# EAGLE design 614_donkey_sch (EAGLE 9.5.1)

## Sheet 1 of 2
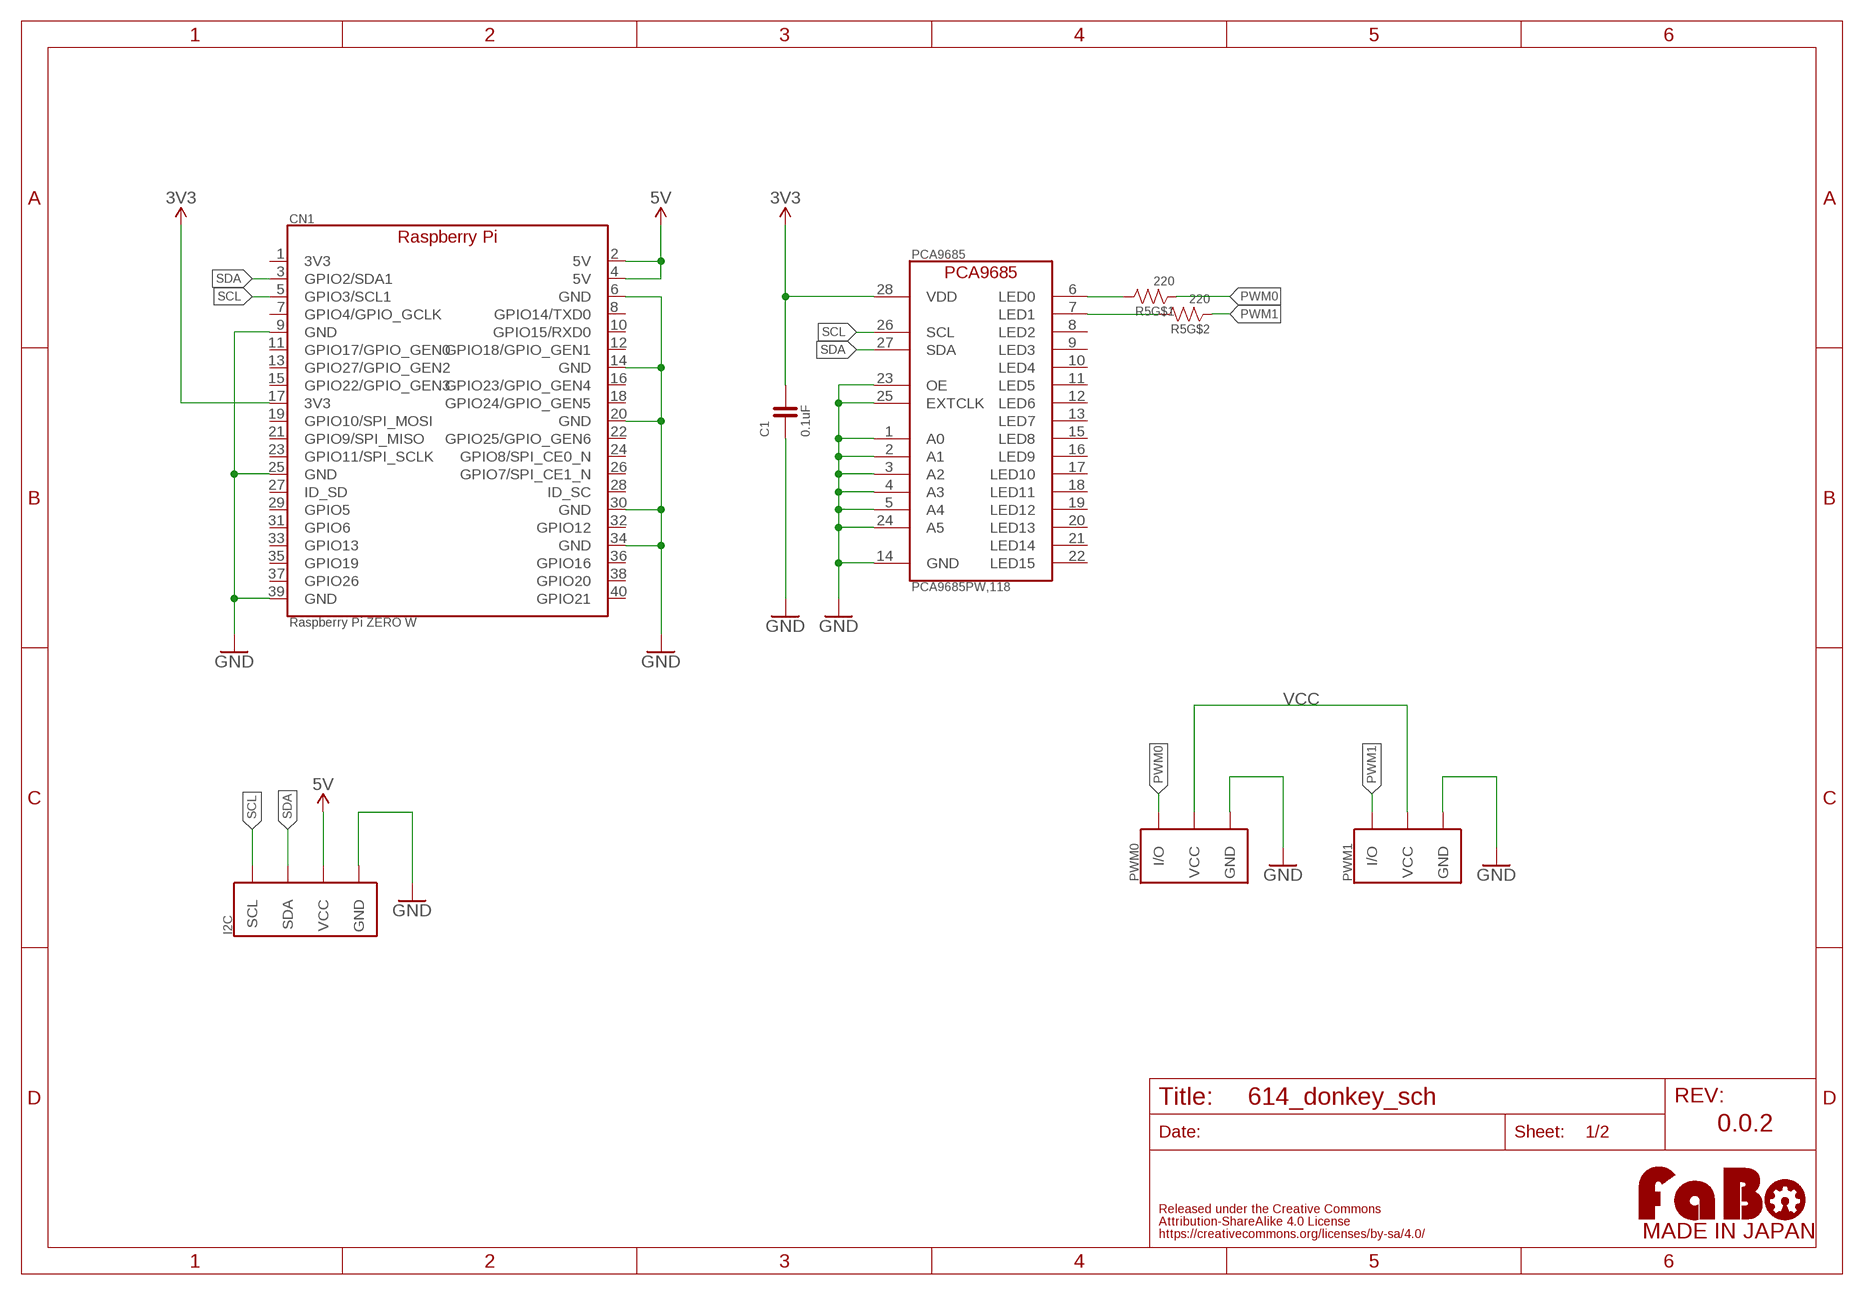
[diagram p0: schematic, sheet 1]

### Parts
C1  0.1uF  CAPACITOR-0603  [EIA0603]
CN1  Raspberry Pi ZERO W  RASPBERRY_CON  [PIN_2X20_NARROW]
I2C  FABO-BRICK-I2C_SIDE_SMD_BOSS  [SM04B-PASS-1]
LOGO1  LOGO_FABO-M  [LOGO_FABO_M]
PCA9685  PCA9685PW,118  PCA9685PW  [TSSOP-28]
PWM0  FABO-BRICK-3PIN_HEADER  [PIN_1X3_NARROW]
PWM1  FABO-BRICK-3PIN_HEADER  [PIN_1X3_NARROW]
R5  220  RESISTOR_ARRAY  [EXBV8V]

### Nets
3V3: C1.2 CN1.17(3V3) PCA9685.28(VDD)
5V: CN1.2(5V) CN1.4(5V) I2C.3(VCC) ; also sheet 2
GND: C1.1 CN1.6(GND) CN1.9(GND) CN1.14(GND) CN1.20(GND) CN1.25(GND) CN1.30(GND) CN1.34(GND) CN1.39(GND) I2C.4(GND) PCA9685.1(A0) PCA9685.2(A1) PCA9685.3(A2) PCA9685.4(A3) PCA9685.5(A4) PCA9685.14(GND) PCA9685.23(OE) PCA9685.24(A5) PCA9685.25(EXTCLK) PWM0.3(GND) PWM1.3(GND) ; also sheet 2
PIN_LED0: PCA9685.6(LED0) R5.8
PIN_LED1: PCA9685.7(LED1) R5.7
PWM0: PWM0.1(I/O) R5.1
PWM1: PWM1.1(I/O) R5.2
SCL: CN1.5(GPIO3/SCL1) I2C.1(SCL) PCA9685.26(SCL) ; also sheet 2
SDA: CN1.3(GPIO2/SDA1) I2C.2(SDA) PCA9685.27(SDA) ; also sheet 2
VCC: PWM0.2(VCC) PWM1.2(VCC)
Unconnected: CN1.1(3V3) CN1.7(GPIO4/GPIO_GCLK) CN1.8(GPIO14/TXD0) CN1.10(GPIO15/RXD0) CN1.11(GPIO17/GPIO_GEN0) CN1.12(GPIO18/GPIO_GEN1) CN1.13(GPIO27/GPIO_GEN2) CN1.15(GPIO22/GPIO_GEN3) CN1.16(GPIO23/GPIO_GEN4) CN1.18(GPIO24/GPIO_GEN5) CN1.19(GPIO10/SPI_MOSI) CN1.21(GPIO9/SPI_MISO) CN1.22(GPIO25/GPIO_GEN6) CN1.23(GPIO11/SPI_SCLK) CN1.24(GPIO8/SPI_CE0_N) CN1.26(GPIO7/SPI_CE1_N) CN1.27(ID_SD) CN1.28(ID_SC) CN1.29(GPIO5) CN1.31(GPIO6) CN1.32(GPIO12) CN1.33(GPIO13) CN1.35(GPIO19) CN1.36(GPIO16) CN1.37(GPIO26) CN1.38(GPIO20) CN1.40(GPIO21) PCA9685.8(LED2) PCA9685.9(LED3) PCA9685.10(LED4) PCA9685.11(LED5) PCA9685.12(LED6) PCA9685.13(LED7) PCA9685.15(LED8) PCA9685.16(LED9) PCA9685.17(LED10) PCA9685.18(LED11) PCA9685.19(LED12) PCA9685.20(LED13) PCA9685.21(LED14) PCA9685.22(LED15) R5.3 R5.4 R5.5 R5.6

### Notes on the sheet
- 0.0.2

## Sheet 2 of 2
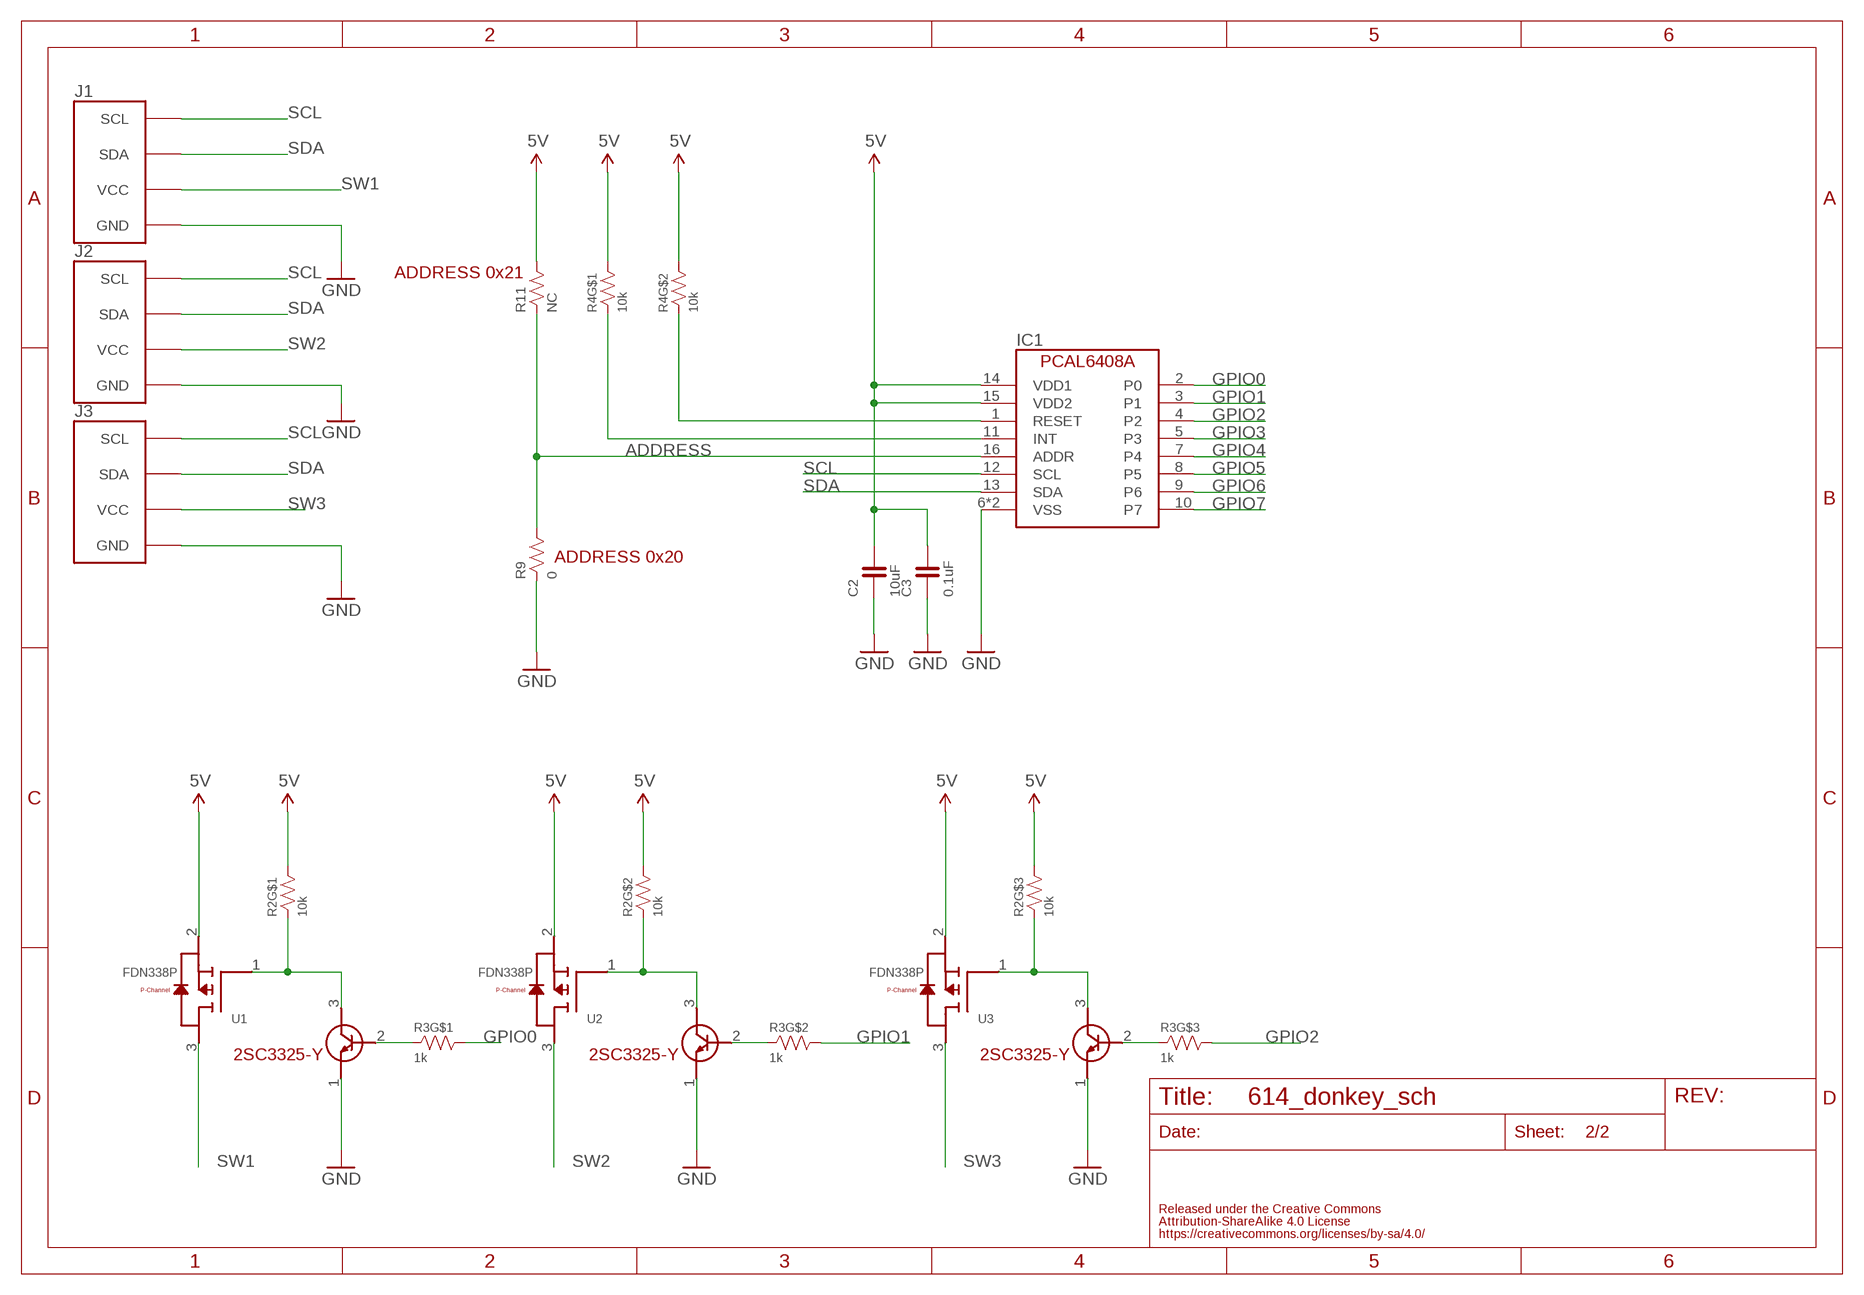
[diagram p1: schematic, sheet 2]

### Parts
C2  10uF  CAPACITOR-0603  [0603]
C3  0.1uF  CAPACITOR-0603  [0603]
IC1  NX-PCAL6408A  [NXP-PCAL6408A]
J1  FABO_BRICK_I2C-S04B-PASK-2  [FABO_BRICK_I2C_S04B-PASK-2]
J2  FABO_BRICK_I2C-S04B-PASK-2  [FABO_BRICK_I2C_S04B-PASK-2]
J3  FABO_BRICK_I2C-S04B-PASK-2  [FABO_BRICK_I2C_S04B-PASK-2]
R2  10k  RESISTOR_ARRAY  [EXBV8V]
R3  1k  RESISTOR_ARRAY  [EXBV8V]
R4  10k  RESISTOR_ARRAY  [EXBV8V]
R9  0  RESISTOR-0603-NARROW  [0603-NARROW]
R11  NC  RESISTOR-0603-NARROW  [0603-NARROW]
T1  2SC3325-Y  [SC-59]
T2  2SC3325-Y  [SC-59]
T3  2SC3325-Y  [SC-59]
U1  FDN338P  [SOT-23]
U2  FDN338P  [SOT-23]
U3  FDN338P  [SOT-23]

### Nets
5V: C2.2 C3.2 IC1.14(VDD1) IC1.15(VDD2) R2.6 R2.7 R2.8 R4.7 R4.8 R11.2 U1.2(S) U2.2(S) U3.2(S) ; also sheet 1
ADDRESS: IC1.16(ADDR) R9.2 R11.1
GND: C2.1 C3.1 IC1.6(VSS) IC1.17(VSS) J1.GND J2.GND J3.GND R9.1 T1.1(E) T2.1(E) T3.1(E) ; also sheet 1
GPIO0: IC1.2(P0) R3.8
GPIO1: IC1.3(P1) R3.7
GPIO2: IC1.4(P2) R3.6
GPIO3: IC1.5(P3)
GPIO4: IC1.7(P4)
GPIO5: IC1.8(P5)
GPIO6: IC1.9(P6)
GPIO7: IC1.10(P7)
N$2: IC1.1(RESET) R4.2
N$3: IC1.11(INT) R4.1
N$4: R2.1 T1.3(C) U1.1(G)
N$5: R2.2 T2.3(C) U2.1(G)
N$6: R3.1 T1.2(B)
N$7: R3.2 T2.2(B)
N$8: R2.3 T3.3(C) U3.1(G)
N$9: R3.3 T3.2(B)
SCL: IC1.12(SCL) J1.SCL J2.SCL J3.SCL ; also sheet 1
SDA: IC1.13(SDA) J1.SDA J2.SDA J3.SDA ; also sheet 1
SW1: J1.VCC U1.3(D)
SW2: J2.VCC U2.3(D)
SW3: J3.VCC U3.3(D)
Unconnected: R2.4 R2.5 R3.4 R3.5 R4.3 R4.4 R4.5 R4.6

### Notes on the sheet
- ADDRESS 0x21
- ADDRESS 0x20

## Library data of the parts
C1 = component:CAPACITOR
C2 C3 = FaBo-Capacitor:CAPACITOR: CAPACITOR
CN1 = component:RASPBERRY_CON
I2C = component:FABO-BRICK-I2C
IC1 = FaBo-Mems:NX-PCAL6408A: NXP PCAL6408A
J1-J3 = FaBo-Template:FABO_BRICK_I2C: FaBo Brick I2C
LOGO1 = component:LOGO_FABO
PCA9685 = component:PCA9685
PWM0 PWM1 = component:FABO-BRICK-3PIN
R2-R5 = component:RESISTOR_ARRAY
R9 R11 = FaBo-Resistors:RESISTOR: RESISTOR
T1-T3 = FaBo-Transistor:2SC3325-Y
U1-U3 = FaBo-Mosfet2:FDN338P

## Board
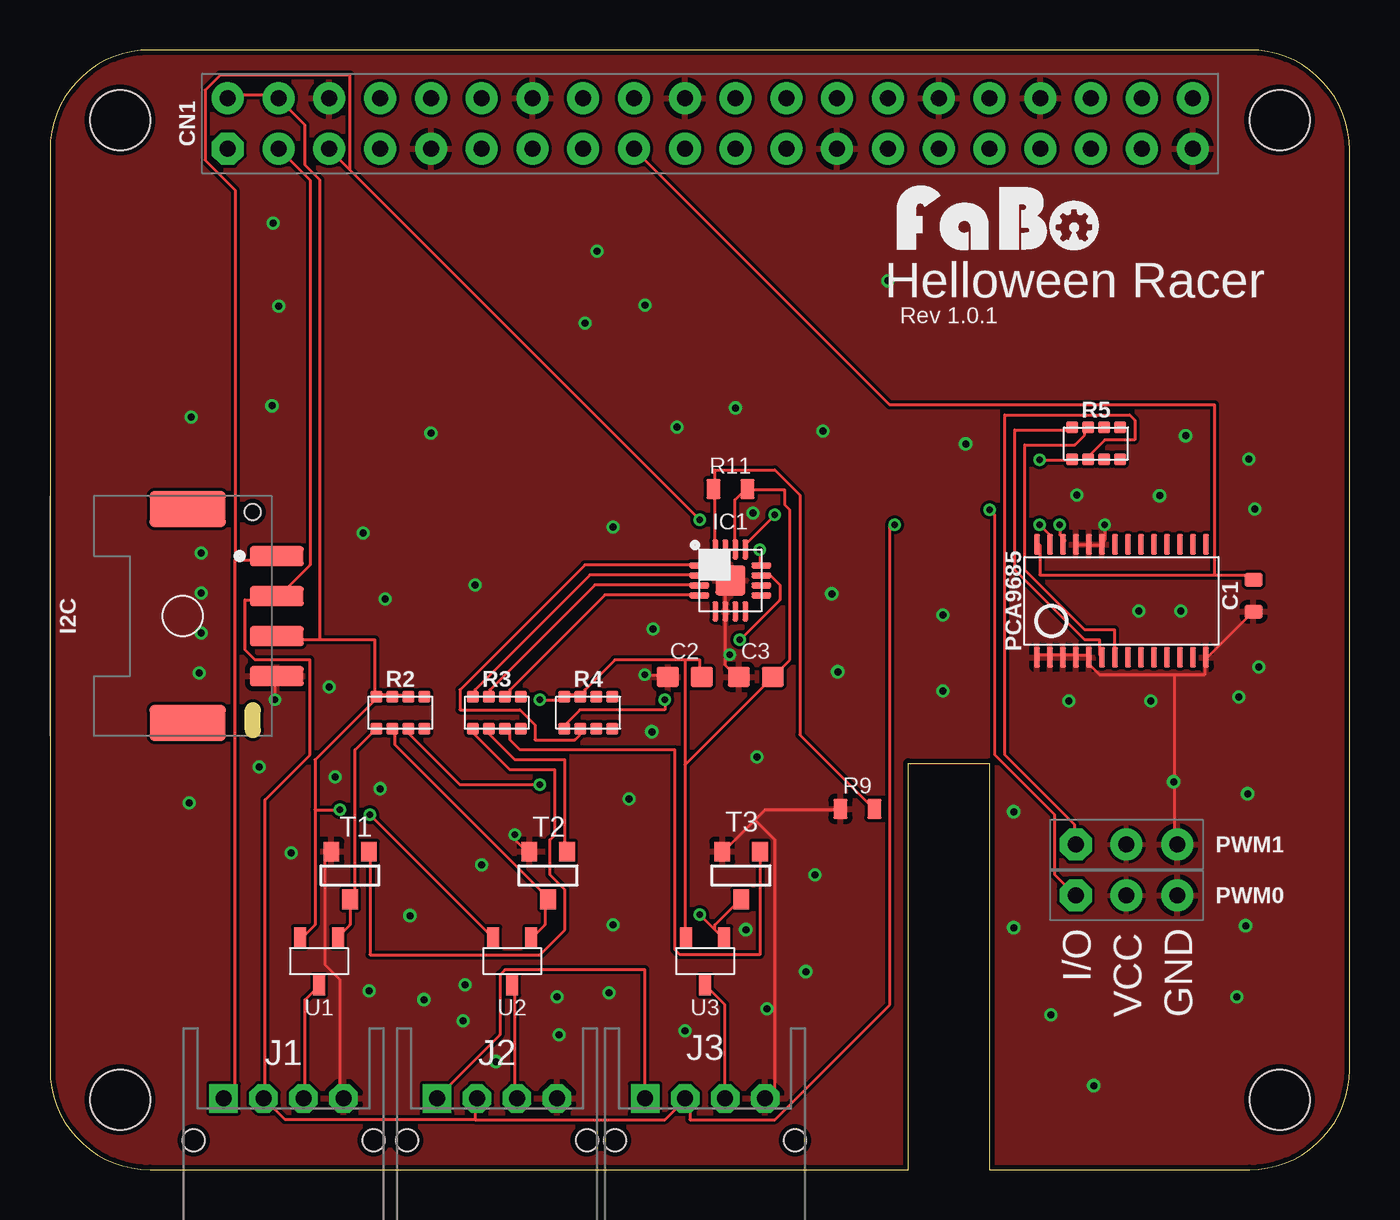
[diagram p2: board, top side]
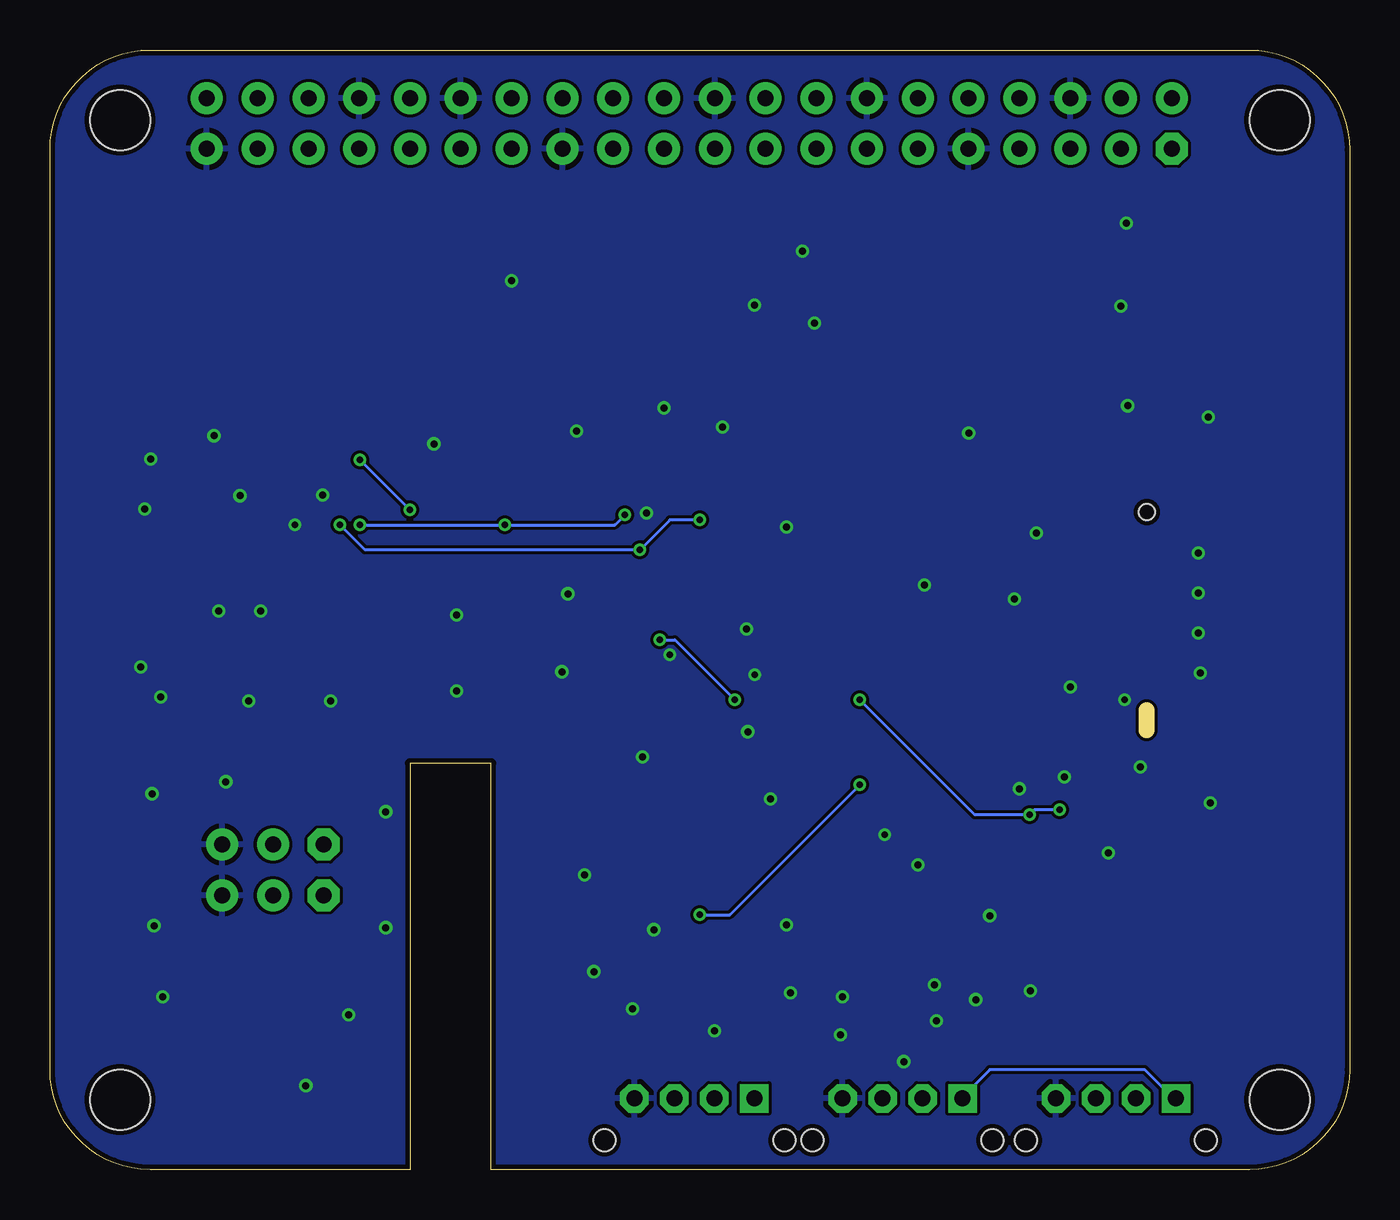
[diagram p3: board, bottom side, seen from below]

Size 65 x 56 mm. Coordinates in mm from the lower left corner, seen from the top.
Outline: 0,51 0,5 arc90 5,0 42.93,0 42.93,20.32 46.99,20.32 46.99,0 60,0 arc90 65,5 65,51 arc90 60,56 5,56 arc90 0,51
Copper layers (1*16): Top 0.035mm / dielectric 1.5mm / Bottom 0.035mm
Design rules "SeeedStudio_2layer_DRU_no_angle_20140221": minimum track width 6mil, minimum drill 12mil, track to track 6mil, track to pad 6mil, pad to pad 6mil, via to via 6mil, smd to smd 0mil, copper to edge 10mil, drill to drill 10mil, minimum pad ring 10mil, minimum via ring 6mil, stop-mask expansion 2mil, vias tented up to drill 100mil, thermal gap 10mil
Holes 3 mm at 3.5,3.5 61.5,3.5 3.5,52.5 61.5,52.5

### Footprints (pad centres in the part's own frame; a part is rotated, then mirrored left to right if it is on the bottom)
EIA0603 = smd 0.65 x 0.9: 1 -0.8,0; 2 0.8,0
0603 = smd 1.1 x 1: 1 -0.85,0; 2 0.85,0
PIN_2X20_NARROW = drill 0.8 pad 1.6 octagon: 1 -24.13,-1.27 | drill 0.8 pad 1.6: 2 -24.13,1.27; 3 -21.59,-1.27; 4 -21.59,1.27; 5 -19.05,-1.27; 6 -19.05,1.27; 7 -16.51,-1.27; 8 -16.51,1.27; 9 -13.97,-1.27; 10 -13.97,1.27; 11 -11.43,-1.27; 12 -11.43,1.27; 13 -8.89,-1.27; 14 -8.89,1.27; 15 -6.35,-1.27; 16 -6.35,1.27; 17 -3.81,-1.27; 18 -3.81,1.27; 19 -1.27,-1.27; 20 -1.27,1.27; 21 1.27,-1.27; 22 1.27,1.27; 23 3.81,-1.27; 24 3.81,1.27; 25 6.35,-1.27; 26 6.35,1.27; 27 8.89,-1.27; 28 8.89,1.27; 29 11.43,-1.27; 30 11.43,1.27; 31 13.97,-1.27; 32 13.97,1.27; 33 16.51,-1.27; 34 16.51,1.27; 35 19.05,-1.27; 36 19.05,1.27; 37 21.59,-1.27; 38 21.59,1.27; 39 24.13,-1.27; 40 24.13,1.27
SM04B-PASS-1 = smd 1 x 2.7: 1 3,-11.85; 2 1,-11.85; 3 -1,-11.85; 4 -3,-11.85 | smd 1.8 x 3.8: P$1 5.35,-7.4; P$2 -5.35,-7.4 | hole 0.8: 5.2,-10.65
NXP-PCAL6408A = smd 1 x 0.3: 1 -1.55,0.75; 2 -1.55,0.25; 3 -1.55,-0.25; 4 -1.55,-0.75; 9 1.55,-0.75; 10 1.55,-0.25; 11 1.55,0.25; 12 1.55,0.75 | smd 0.3 x 1: 5 -0.75,-1.55; 6 -0.25,-1.55; 7 0.25,-1.55; 8 0.75,-1.55; 13 0.75,1.55; 14 0.25,1.55; 15 -0.25,1.55; 16 -0.75,1.55 | smd 1.5 x 1.5: 17 0,0
FABO_BRICK_I2C_S04B-PASK-2 = drill 0.8 pad 1.422 octagon: GND -3,0; SDA 1,0; VCC -1,0 | drill 0.8 pad 1.422 square: SCL 3,0 | hole 1.1: 4.5,2.1; -4.5,2.1
TSSOP-28 = smd 0.3 x 1: 1 -4.225,-2.825; 2 -3.575,-2.825; 3 -2.925,-2.825; 4 -2.275,-2.825; 5 -1.625,-2.825; 6 -0.975,-2.825; 7 -0.325,-2.825; 8 0.325,-2.825; 9 0.975,-2.825; 10 1.625,-2.825; 11 2.275,-2.825; 12 2.925,-2.825; 13 3.575,-2.825; 14 4.225,-2.825; 15 4.225,2.825; 16 3.575,2.825; 17 2.925,2.825; 18 2.275,2.825; 19 1.625,2.825; 20 0.975,2.825; 21 0.325,2.825; 22 -0.325,2.825; 23 -0.975,2.825; 24 -1.625,2.825; 25 -2.275,2.825; 26 -2.925,2.825; 27 -3.575,2.825; 28 -4.225,2.825
PIN_1X3_NARROW = drill 0.8 pad 1.6 octagon: 1 -2.54,0 | drill 0.8 pad 1.6: 2 0,0; 3 2.54,0
EXBV8V = smd 0.6 x 0.6: 1 -1.2,-0.8; 2 -0.4,-0.8; 3 0.4,-0.8; 4 1.2,-0.8; 5 1.2,0.8; 6 0.4,0.8; 7 -0.4,0.8; 8 -1.2,0.8
0603-NARROW = smd 0.71 x 1: 1 -0.85,0; 2 0.85,0
SC-59 = smd 0.787 x 0.991: 1 -0.914,1.168; 2 0.965,1.168; 3 0.025,-1.219
SOT-23 = smd 0.6 x 1: 1 -0.95,-1.2; 2 0.95,-1.2; 3 0,1.2

### Placement (x,y rotation side)
C1  60.2,28.7 90 top
C2  31.75,24.64 0 top
C3  35.31,24.64 0 top
CN1  33.02,52.32 0 top
I2C  -0.51,27.69 90 top
IC1  34.04,29.46 0 top
J1  11.68,3.56 180 top
J2  22.35,3.56 180 top
J3  32.77,3.56 180 top
LOGO1  47.41,45.6 0 top
PCA9685  53.59,28.45 0 top
PWM0  53.85,13.72 0 top
PWM1  53.85,16.26 0 top
R2  17.53,22.86 0 top
R3  22.35,22.86 0 top
R4  26.92,22.86 0 top
R5  52.32,36.32 0 top
R9  40.39,18.03 0 top
R11  34.04,34.04 0 top
T1  14.99,14.73 0 top
T2  24.89,14.73 0 top
T3  34.54,14.73 0 top
U1  13.46,10.41 180 top
U2  23.11,10.41 180 top
U3  32.77,10.41 180 top

### Tracks (layer width: path | path; a pad name or v marks a point on that pad's centre or on a via)
3V3
  Top 0.152: 58.25,29.75 49.5,29.75 49.5,31.25 PCA9685.28 | 58.25,29.75 60,29.75 C1.2 | 58.25,29.75 58.25,38.25 42,38.25 29.25,51 CN1.17
5V  (via drill 0.3)
  Top 0.152: IC1.15 33.75,31 34.25,31 IC1.14 34.25,31.25 34.25,33.5 34.75,34 R11.2 35,34 36.75,34 36.75,33.25 37,33 37,25.5 36.25,24.75 C3.2 36,24.5 31.75,20.25 | 31.75,25.5 32.5,25.5 32.5,24.75 C2.2 | 31.75,25.5 28.25,25.5 26.75,24 26.75,23.75 R4.7 26.5,23.75 25.75,23.75 R4.8 25.5,23.5 v24.5,23.5 | 31.75,25.5 31.75,20.25 | 31.75,20.25 31.75,11.75 U3.2 | CN1.2 9,53.75 11.25,53.75 CN1.4 11.5,53.5 12.75,52.25 12.75,50.25 13.5,49.5 13.5,26.5 | R2.8 16.5,23.75 17,23.75 R2.7 17.25,23.75 17.75,23.75 R2.6 | 13.25,18 13.25,20.5 16.25,23.5 R2.8 | 13.25,18 13.25,12.25 12.75,11.75 U1.2 | v16,17.75 22,11.75 U2.2 | 13.25,18 v14.5,18 | 13.5,26.5 16.25,26.5 16.25,23.75 R2.8 | 13.5,26.5 11.5,26.5 I2C.3
  Bottom 0.152: v14.5,18 15.75,18 v16,17.75 18.75,17.75 v24.5,23.5
ADDRESS
  Top 0.152: IC1.16 33.25,31.25 33.25,34 R11.1 33.25,34.25 33.25,35 36.25,35 37.5,33.75 37.5,21.75 41,18.25 R9.2
GND  (via drill 0.3, 0.35)
  Top 0.152: 50,25.75 49.5,25.75 PCA9685.1 | 51.25,25.75 50.75,25.75 | 51.25,25.75 52,25.75 PCA9685.5 52,25.5 52,25.25 52.5,24.75 56.25,24.75 | 51.25,25.75 PCA9685.4 | 50.75,25.75 50,25.75 | 50,25.75 PCA9685.2 | 50.75,25.75 PCA9685.3 | 57.75,25.5 60,27.75 C1.1 | 56.25,24.75 57.75,24.75 57.75,25.5 | 57.75,25.5 PCA9685.14 | 35.25,17.5 35.75,18 39.5,18 R9.1 | 35.25,17.5 33.75,16 T3.1 | IC1.17 34,29.25 33.75,29 33.75,28 IC1.6 33.75,27.75 33.75,25.75 | 33.75,25.75 33.75,25.25 34.25,24.75 C3.1 | 52,31.25 51.25,31.25 PCA9685.25 | 52,31.25 52.5,31.25 PCA9685.23 52.75,31.5 v52.75,32.25 | 52,31.25 PCA9685.24 | T1.1 14,15.75 13.75,15.5 13.75,10.25 14.5,9.5 14.5,3.75 J1.GND | v23.25,16.75 23.25,16.5 23.75,16 T2.1 | v29.75,24.75 30.75,24.75 C2.1 | v11.25,23.5 11.25,24.5 I2C.4 | v34,25.75 33.75,25.75 | 35.25,17.5 36.25,16.5 36.25,4 36,3.75 J3.GND | 56.25,24.75 56.25,16.5 PWM1.3
  other vias: 19.05,36.83 11.43,43.18 34.29,38.1 41.91,44.45 21.59,15.24 16.51,19.05 13.97,24.13 22.3,5.4 18.7,8.5 18,12.7 34.8,12 30.1,21.9 11.1,38.2 39.4,24.9 37.8,9.9 52.2,4.2 59.8,12.2 48.2,12.1 59.9,18.8 48.2,17.9 39.1,28.8 55.5,33.7 56.8,36.7 45.8,36.3 56.2,19.4 14.27,19.63 28.97,18.53 35.37,20.63 35.17,32.83 38.67,36.93 31.37,37.13 28.17,32.13 16.77,28.53 15.67,31.83 7.57,30.83 7.57,28.83 7.57,26.83 7.47,24.83 10.47,20.13 12.07,15.83 15.97,8.93 20.77,9.23 20.67,7.43 25.37,8.63 27.97,8.83 25.47,6.73 28.17,12.23 31.77,6.93 35.87,8.03 30.17,27.03 21.27,29.23 7.07,37.63 6.97,18.33 51.37,33.73 59.97,35.53 60.27,33.03 60.47,25.13 56.57,27.93 54.47,27.93 50.97,23.43 55.07,23.43 59.47,23.63 44.67,27.73 44.67,23.93 38.27,14.73 50.07,7.73 59.37,8.63 11.17,47.33 27.37,45.93 29.77,43.23 26.77,42.33
  pour Bottom (rank 2): 0,-1.27 67.31,-1.27 67.31,57.15 -1.27,57.15 -1.27,-1.27
  pour Top: 0,0 0,55.88 64.77,55.88 64.77,0
  pour Bottom: 0,0 0,55.88 64.77,55.88 64.77,0
GPIO0
  Top 0.152: R3.8 21.25,23.75 21.25,24 27,29.75 32.25,29.75 IC1.2
GPIO1
  Top 0.152: R3.7 22,23.75 22,24 27.25,29.25 32.25,29.25 IC1.3
GPIO2
  Top 0.152: R3.6 23,23.75 23,24 27.75,28.75 32.25,28.75 IC1.4
N$2
  Top 0.152: R4.2 26.5,22 26.5,21.75 26.25,21.5 24.25,21.5 24.25,22.25 23.5,23 20.5,23 20.5,24 26.75,30.25 32.25,30.25 IC1.1
N$3  (via drill 0.3)
  Top 0.152: v30.75,23.5 30.75,23 26.5,23 25.75,22.25 R4.1 | v34.5,26.5 36.5,28.5 36.5,29.25 36,29.75 35.75,29.75 IC1.11
  Bottom 0.152: v30.75,23.5 33.75,26.5 v34.5,26.5
N$4
  Top 0.152: R2.1 16.25,22 15.25,21 15.25,13.75 T1.3 15,12.25 14.5,11.75 U1.1
N$5
  Top 0.152: R2.2 17.25,22 17.25,21.25 24.75,13.75 T2.3 24.75,13.5 24.75,12.25 24.25,11.75 U2.1
N$6
  Top 0.152: R3.1 21.25,22 21.25,21.75 23,20 25.25,20 25.25,16.75 25,16.5 25,14.75 25.75,14 25.75,12 24.5,10.75 16,10.75 16,15.75 T1.2
N$7
  Top 0.152: R3.2 22,22 22,21.75 23.25,20.5 25.75,20.5 25.75,16 T2.2
N$8  (via drill 0.3)
  Top 0.152: v24.5,19.25 20.5,19.25 18,21.75 18,22 R2.3 | 33.25,12 33.5,11.75 U3.1 | 33.25,12 v32.5,12.75 | 33.25,12 33.25,12.25 34.5,13.5 T3.3
  Bottom 0.152: v24.5,19.25 31,12.75 v32.5,12.75
N$9
  Top 0.152: R3.3 23,22 23,21.5 23.5,21 31.25,21 31.25,11 31.5,10.75 35.5,10.75 35.5,15.75 T3.2
PIN_LED0
  Top 0.152: R5.8 51,37 48.25,37 48.25,30 51.75,26.5 52.5,26.5 52.5,25.75 PCA9685.6
PIN_LED1
  Top 0.152: R5.7 51.75,37 51.75,36.75 51.25,36.25 48.75,36.25 48.75,30 51.75,27 53.25,27 53.25,25.75 PCA9685.7
PWM0  (via drill 0.3)
  Top 0.152: v49.5,35.5 51,35.5 R5.1 | v47,33 47.25,32.75 47.25,20.75 50.25,17.75 50.25,14.75 51.25,13.75 PWM0.1
  Bottom 0.152: v47,33 v49.5,35.5
PWM1
  Top 0.152: R5.2 52,35.75 52.75,36.5 54.25,36.5 54.25,37.5 54,37.75 47.75,37.75 47.75,20.75 51.25,17.25 51.25,16.5 PWM1.1
SCL  (via drill 0.3)
  Top 0.152: J2.SCL 19.5,3.75 22.5,6.75 22.5,9.75 22.75,10 29.75,10 29.75,3.75 J3.SCL | 9.25,30.5 11.25,30.5 I2C.1 | 9.25,30.5 9.25,4.25 8.75,3.75 J1.SCL | v35.5,31 35.5,30.25 IC1.12 | 15,50 14,51 CN1.5 | 15,50 v32.5,32.5 | v50.5,32.25 50.5,31.75 50.75,31.5 PCA9685.26 | 9.25,30.5 9.25,49 7.75,50.5 7.75,54 8.5,54.75 15,54.75 15,50
  Bottom 0.152: J2.SCL 19.25,3.75 18,5 10.25,5 9,3.75 8.75,3.75 J1.SCL | v32.5,32.5 34,32.5 v35.5,31 49.25,31 v50.5,32.25
SDA  (via drill 0.3)
  Top 0.152: CN1.3 11.5,51 13,49.5 13,30.25 11.5,28.75 I2C.2 11.25,28.5 9.75,28.5 9.75,26 10.25,25.5 13,25.5 13,20.75 10.75,18.5 10.75,3.75 J1.SDA 10.75,3.5 11.75,2.5 21.25,2.5 | v36.25,32.75 34.75,31.25 IC1.13 | v49.5,32.25 50,31.75 50,31.5 PCA9685.27 | 21.25,2.5 21.25,3.5 J2.SDA | 21.25,2.5 30.75,2.5 31.75,3.5 J3.SDA 32,3.5 32,2.5 36.25,2.5 42,8.25 42,32.25 v42.25,32.25
  Bottom 0.152: v36.25,32.75 36.75,32.25 v42.25,32.25 v49.5,32.25
SW1
  Top 0.152: U1.3 13.25,9 12.75,8.5 12.75,3.75 J1.VCC
SW2
  Top 0.152: U2.3 23.25,9 23.25,3.75 J2.VCC
SW3
  Top 0.152: U3.3 33,9 33.75,8.25 33.75,3.75 J3.VCC
VCC
  pour Top: 52.83,17.78 52.83,12.19 54.86,12.19 54.86,17.78

### Text on the board
tPlace: Helloween Racer | Rev 1.0.1 | I/O | VCC | GND